# EAGLE design connector (EAGLE 6.5.0)
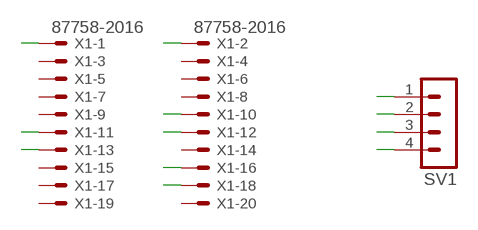
[diagram p0: schematic, sheet 1]

## Parts
SV1  MA04-1  [MA04-1]
X1  87758-2016  [87758-2016]

## Nets
GND: SV1.2 X1.10 X1.13 X1.16 X1.18
RX: SV1.4 X1.12
TX: SV1.3 X1.11
VCC: SV1.1 X1.1 X1.2
Unconnected: X1.3 X1.4 X1.5 X1.6 X1.7 X1.8 X1.9 X1.14 X1.15 X1.17 X1.19 X1.20

## Library data of the parts
SV1 = con-lstb:MA04-1: PIN HEADER; OC_FARNELL: unknown; OC_NEWARK: unknown
X1 = con-molex:87758-2016: 20 Pin - 2mm Dual Row Single Wafer, Vertical T/H HDR Source: http://www.molex.com/pdm_docs/sd/877580616_sd.pdf; MPN: 87758-2016; OC_FARNELL: 7472374; OC_NEWARK: 25M5677

## Board
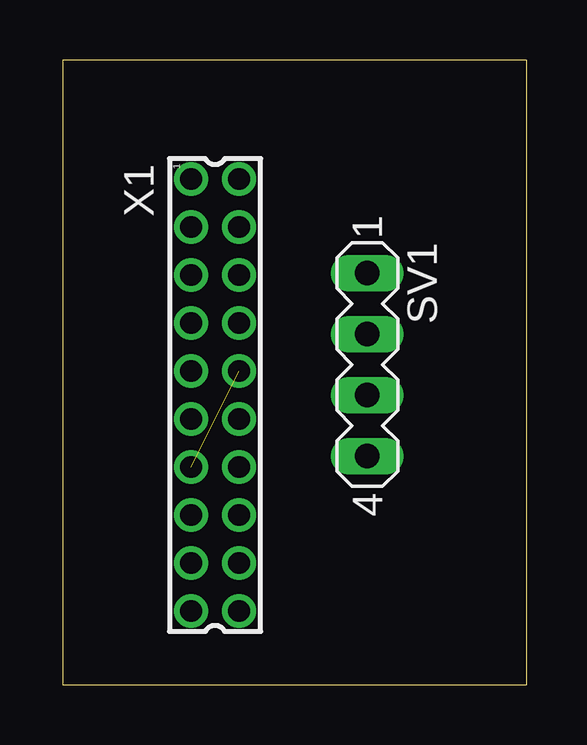
[diagram p1: board, top side]
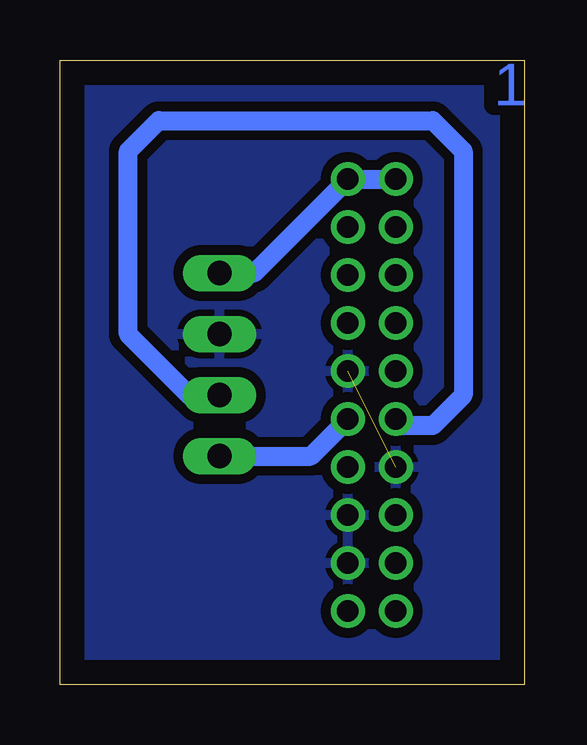
[diagram p2: board, bottom side, seen from below]

Size 19.36 x 26.03 mm. Coordinates in mm from the lower left corner, seen from the top.
Outline: 0,0 19.36,0 19.36,26.03 0,26.03 0,0
Copper layers (1*16): Top 0.035mm / dielectric 1.5mm / Bottom 0.035mm
Design rules "default": minimum track width 10mil, minimum drill 24mil, track to track 8mil, track to pad 8mil, pad to pad 8mil, via to via 8mil, smd to smd 8mil, copper to edge 40mil, drill to drill 8mil, minimum pad ring 10mil, minimum via ring 8mil, stop-mask expansion 4mil, vias tented up to drill 0mil, thermal gap 10mil

### Footprints (pad centres in the part's own frame; a part is rotated, then mirrored left to right if it is on the bottom)
MA04-1 = drill 1.016 long: 1 -3.81,0; 2 -1.27,0; 3 1.27,0; 4 3.81,0
87758-2016 = drill 0.9 pad 1.27: 1 -9,-1; 2 -9,1; 3 -7,-1; 4 -7,1; 5 -5,-1; 6 -5,1; 7 -3,-1; 8 -3,1; 9 -1,-1; 10 -1,1; 11 1,-1; 12 1,1; 13 3,-1; 14 3,1; 15 5,-1; 16 5,1; 17 7,-1; 18 7,1; 19 9,-1; 20 9,1

### Placement (x,y rotation side)
SV1  12.7,13.33 270 top
X1  6.35,12.06 270 top

### Tracks (layer width: path | path; a pad name or v marks a point on that pad's centre or on a via)
GND  (1 unrouted)
  pour Bottom (isolate 0.406): 0,0.64 0,25.4 19.05,25.4 19.05,0.64
RX
  Bottom 0.8: SV1.4 8.89,9.53 X1.12
TX
  Bottom 0.406: SV1.3 13.97,12.06 | 5.08,10.79 X1.11
  Bottom 0.8: 13.97,12.06 16.51,14.6 16.51,22.23 15.24,23.5 3.81,23.5 2.54,22.23 2.54,12.06 3.81,10.79 5.08,10.79
VCC
  Bottom 0.406: SV1.1 11.27,17.14
  Bottom 0.8: 11.27,17.14 X1.2 X1.1

### Text on the board
Bottom: 1